# EAGLE design AGG_OBD (EAGLE 7.7.0)
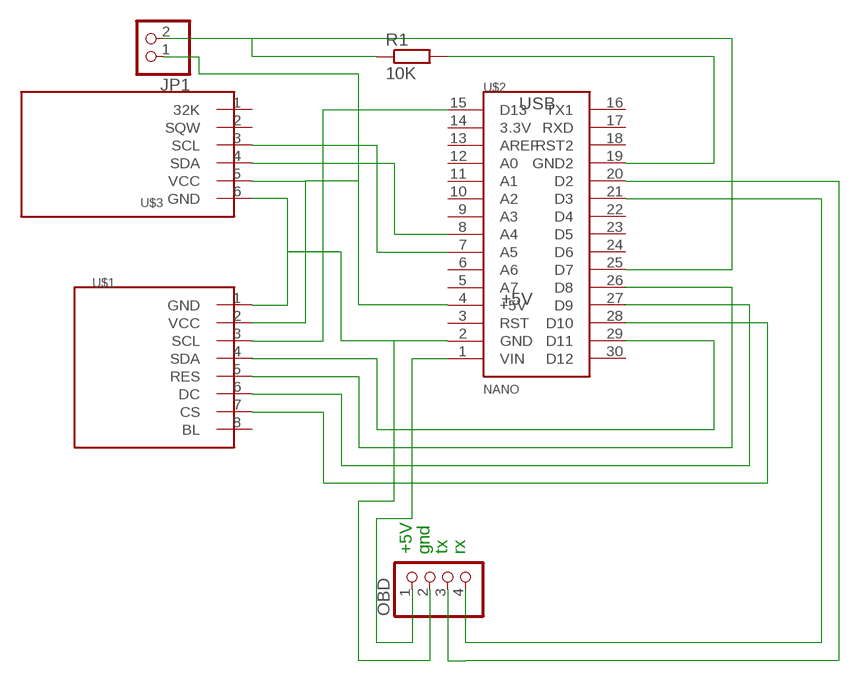
[diagram p0: schematic, sheet 1]

## Parts
JP1  PINHD-1X2  [1X02]
OBD  PINHD-1X4  [1X04]
R1  10K  R-EU_0207/5V  [0207/5V]
U$1  DISPLAY_TFT_LCD_128X160  [DISPLAYTFT_LCD128X160]
U$2  NANO  [NANO]
U$3  DS3231DS3231  [DS3231]

## Nets
N$2: U$1.5(RES) U$2.26(D8)
N$3: JP1.1 U$1.2(VCC) U$2.4(+5V) U$3.5(VCC)
N$4: U$1.6(DC) U$2.27(D9)
N$5: U$2.7(A5) U$3.3(SCL)
N$6: U$2.8(A4) U$3.4(SDA)
N$7: U$1.3(SCL) U$2.15(D13)
N$8: U$1.4(SDA) U$2.29(D11)
N$9: U$1.7(CS) U$2.28(D10)
N$10: JP1.2 R1.1 U$2.25(D7)
N$11: R1.2 U$2.19(GND2)
N$12: OBD.1 U$2.1(VIN)
N$13: OBD.2 U$1.1(GND) U$2.2(GND) U$3.6(GND)
N$14: OBD.4 U$2.21(D3)
N$15: OBD.3 U$2.20(D2)
Unconnected: U$1.8(BL) U$2.3(RST) U$2.5(A7) U$2.6(A6) U$2.9(A3) U$2.10(A2) U$2.11(A1) U$2.12(A0) U$2.13(AREF) U$2.14(3.3V) U$2.16(TX1) U$2.17(RXD) U$2.18(RST2) U$2.22(D4) U$2.23(D5) U$2.24(D6) U$2.30(D12) U$3.1(32K) U$3.2(SQW)

## Notes on the sheet
- +5V | gnd | tx | rx

## Library data of the parts
JP1 = pinhead:PINHD-1X2: PIN HEADER
OBD = pinhead:PINHD-1X4: PIN HEADER
R1 = resistor:R-EU_: RESISTOR, European symbol
U$1 = Display TFT_LCD 128x160:DISPLAY_TFT_LCD_128X160
U$2 = Nano:NANO
U$3 = DS3231:DS3231

## Board
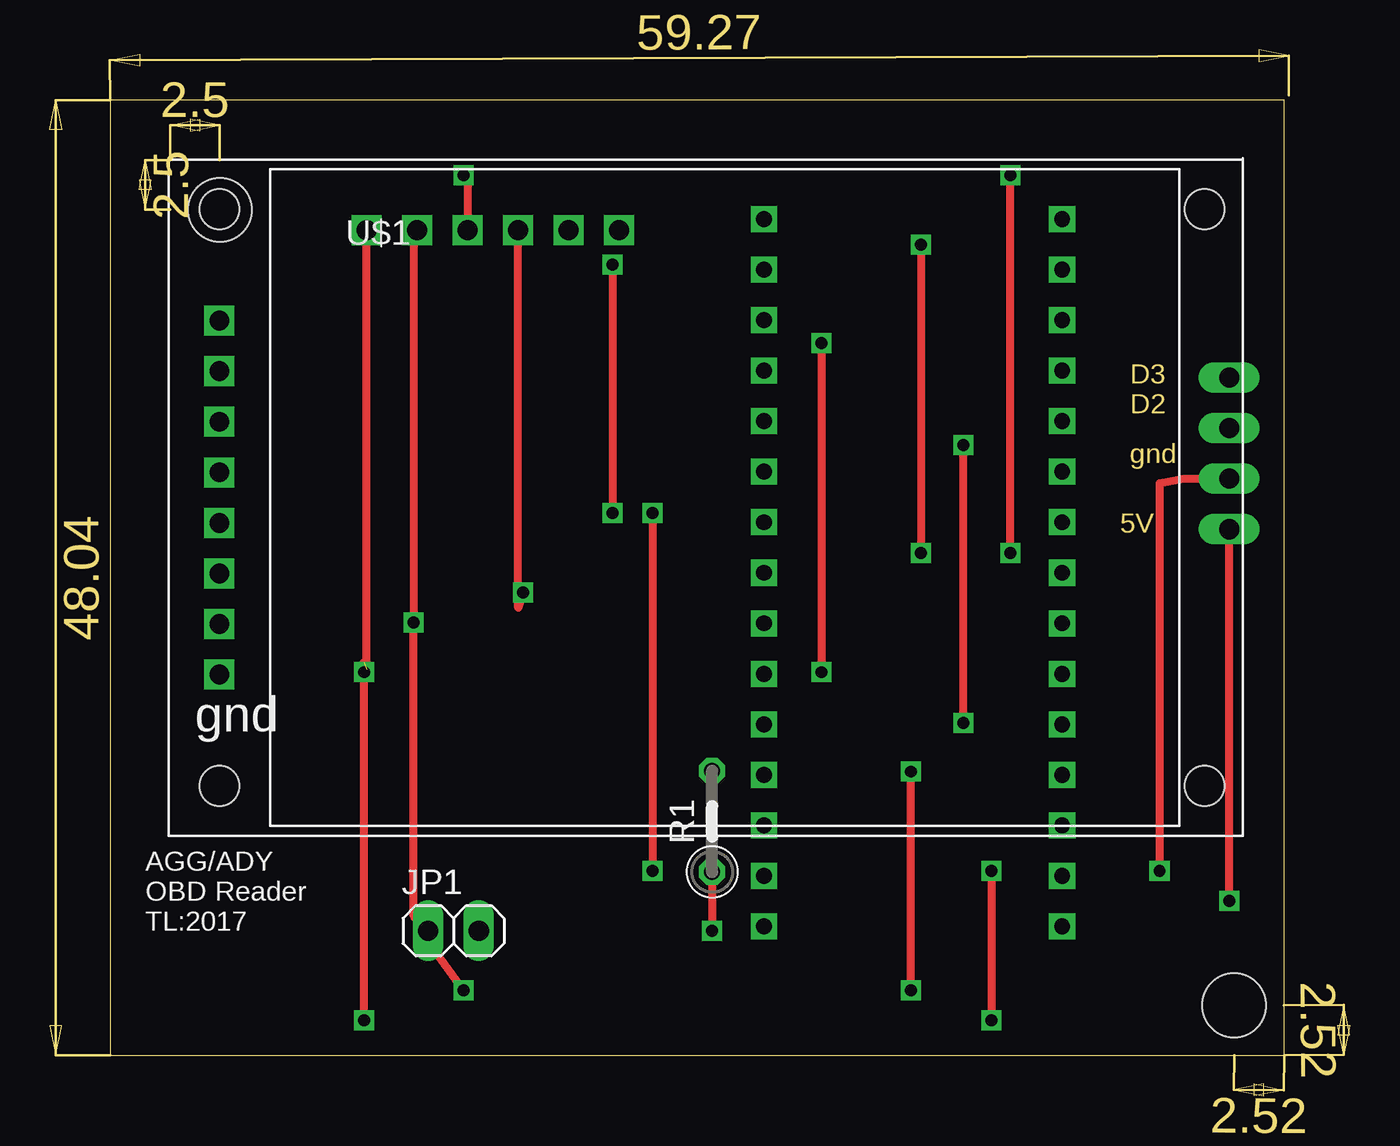
[diagram p1: board, top side]
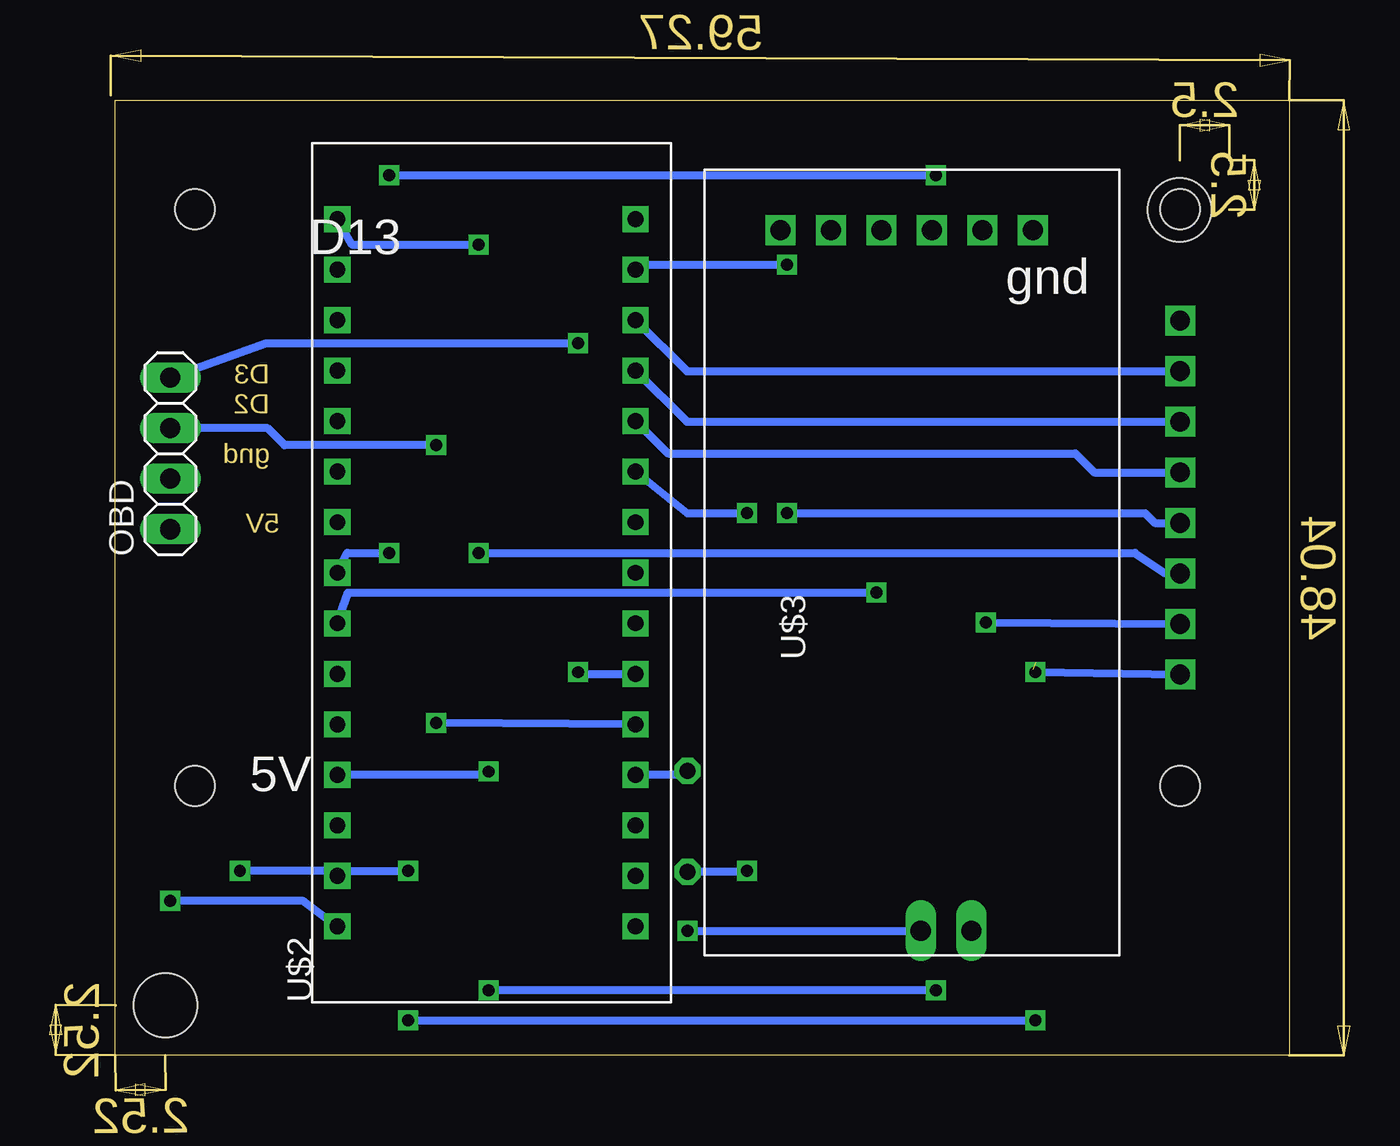
[diagram p2: board, bottom side, seen from below]

Size 59.04 x 48.04 mm. Coordinates in mm from the lower left corner, seen from the top.
Outline: 0,0 59.04,0 59.04,48.04 0,48.04 0,0
Copper layers (1*16): Top 0.035mm / dielectric 1.5mm / Bottom 0.035mm
Design rules "default": minimum track width 10mil, minimum drill 24mil, track to track 8mil, track to pad 8mil, pad to pad 8mil, via to via 8mil, smd to smd 8mil, copper to edge 40mil, drill to drill 8mil, minimum pad ring 10mil, minimum via ring 8mil, stop-mask expansion 4mil, vias tented up to drill 0mil, thermal gap 10mil
Holes 3.2 mm at 56.52,2.52 5.52,42.52

### Footprints (pad centres in the part's own frame; a part is rotated, then mirrored left to right if it is on the bottom)
1X02 = drill 1.016 long: 1 -1.27,0; 2 1.27,0
1X04 = drill 1.016 long: 1 -3.81,0; 2 -1.27,0; 3 1.27,0; 4 3.81,0
0207/5V = drill 0.813 octagon: 1 -2.54,0; 2 2.54,0
DISPLAYTFT_LCD128X160 = drill 1 square: 1 -17.78,-10.16; 2 -17.78,-7.62; 3 -17.78,-5.08; 4 -17.78,-2.54; 5 -17.78,0; 6 -17.78,2.54; 7 -17.78,5.08; 8 -17.78,7.62 | hole 2: -17.78,13.23; 31.75,13.23; 31.75,-15.77; -17.78,-15.77
NANO = drill 0.8 square: 1 -19.05,8.89; 2 -16.51,8.89; 3 -13.97,8.89; 4 -11.43,8.89; 5 -8.89,8.89; 6 -6.35,8.89; 7 -3.81,8.89; 8 -1.27,8.89; 9 1.27,8.89; 10 3.81,8.89; 11 6.35,8.89; 12 8.89,8.89; 13 11.43,8.89; 14 13.97,8.89; 15 16.51,8.89; 16 -19.05,-6.11; 17 -16.51,-6.11; 18 -13.97,-6.11; 19 -11.43,-6.11; 20 -8.89,-6.11; 21 -6.35,-6.11; 22 -3.81,-6.11; 23 -1.27,-6.11; 24 1.27,-6.11; 25 3.81,-6.11; 26 6.35,-6.11; 27 8.89,-6.11; 28 11.43,-6.11; 29 13.97,-6.11; 30 16.51,-6.11
DS3231 = drill 1 square: 1 13.97,3.81; 2 13.97,1.27; 3 13.97,-1.27; 4 13.97,-3.81; 5 13.97,-6.35; 6 13.97,-8.89

### Placement (x,y rotation side)
JP1  17.27,6.27 0 top
OBD  56.27,30.27 90 bottom
R1  30.27,11.77 90 top
U$1  23.28,29.32 0 top
U$2  38.98,25.54 90 bottom
U$3  21.79,27.53 90 bottom

### Tracks (layer width: path | path; a pad name or v marks a point on that pad's centre or on a via)
N$2
  Bottom 0.406: U$2.26 31.25,30.27 10.77,30.27 9.82,29.32 U$1.5
N$3  (via drill 0.6)
  Top 0.406: v17.77,3.27 15.77,6.04 JP1.1 15.27,7 v15.27,21.77 15.27,41.33 U$3.5 | v40.27,3.27 v40.27,14.27
  Bottom 0.406: v15.27,21.77 U$1.2 | v17.77,3.27 v40.27,3.27 | v40.27,14.27 40.43,14.11 U$2.4
N$4
  Bottom 0.406: U$2.27 30.3,31.86 U$1.6
N$5  (via drill 0.6)
  Top 0.406: v20.77,23.27 20.52,22.52 U$3.3
  Bottom 0.406: U$2.7 47.33,23.27 v20.77,23.27
N$6  (via drill 0.6)
  Top 0.406: v45.27,25.27 v45.27,44.27 | v17.77,44.27 17.98,43.98 U$3.4
  Bottom 0.406: U$2.8 47.37,25.27 v45.27,25.27 | v45.27,44.27 v17.77,44.27
N$7  (via drill 0.6)
  Top 0.406: v40.77,40.77 v40.77,25.27
  Bottom 0.406: U$2.15 47.15,40.77 v40.77,40.77 | v40.77,25.27 7.77,25.27 6.24,24.24 U$1.3
N$8  (via drill 0.6)
  Top 0.406: v25.27,39.77 v25.27,27.27
  Bottom 0.406: U$2.29 32.61,39.77 v25.27,39.77 | v25.27,27.27 7.27,27.27 6.78,26.78 U$1.4
N$9
  Bottom 0.406: U$2.28 30.3,34.4 U$1.7
N$10  (via drill 0.6)
  Top 0.406: R1.1 v30.27,6.27 | v27.27,27.27 v27.27,9.27
  Bottom 0.406: v30.27,6.27 JP1.2 | U$2.25 30.29,27.27 v27.27,27.27 | v27.27,9.27 27.31,9.23 R1.1
N$11
  Bottom 0.406: R1.2 30.47,14.11 U$2.19
N$12  (via drill 0.6)
  Top 0.406: v56.27,7.77 OBD.1
  Bottom 0.406: U$2.1 49.59,7.77 v56.27,7.77
N$13  (via drill 0.6)  (1 unrouted)
  Top 0.406: v44.31,9.27 v44.31,1.77 | v12.77,1.77 12.77,3.27 12.77,19.77 | v52.77,9.27 52.77,28.77 54,29 OBD.2 | v12.77,19.27 12.9,19.4 U$3.6
  Bottom 0.406: v12.77,19.27 U$1.1 | v52.77,9.27 48.11,9.27 U$2.2 47.63,9.27 v44.31,9.27 | v44.31,1.77 v12.77,1.77
N$14  (via drill 0.6)
  Top 0.406: v35.77,35.81 v35.77,19.27
  Bottom 0.406: OBD.4 51.46,35.81 v35.77,35.81 | v35.77,19.27 35.69,19.19 U$2.21
N$15  (via drill 0.6)
  Top 0.406: v42.91,16.72 v42.91,30.69
  Bottom 0.406: U$2.20 v42.91,16.72 | v42.91,30.69 50.53,30.69 51.38,31.54 OBD.3

### Text on the board
Dimension: D3 | D2 | gnd | 5V
tNames: gnd | AGG/ADY / OBD Reader / TL:2017
bNames: D13 | gnd | 5V